# EAGLE schematic MicroMod_STM32_Processor (EAGLE 9.6.2)
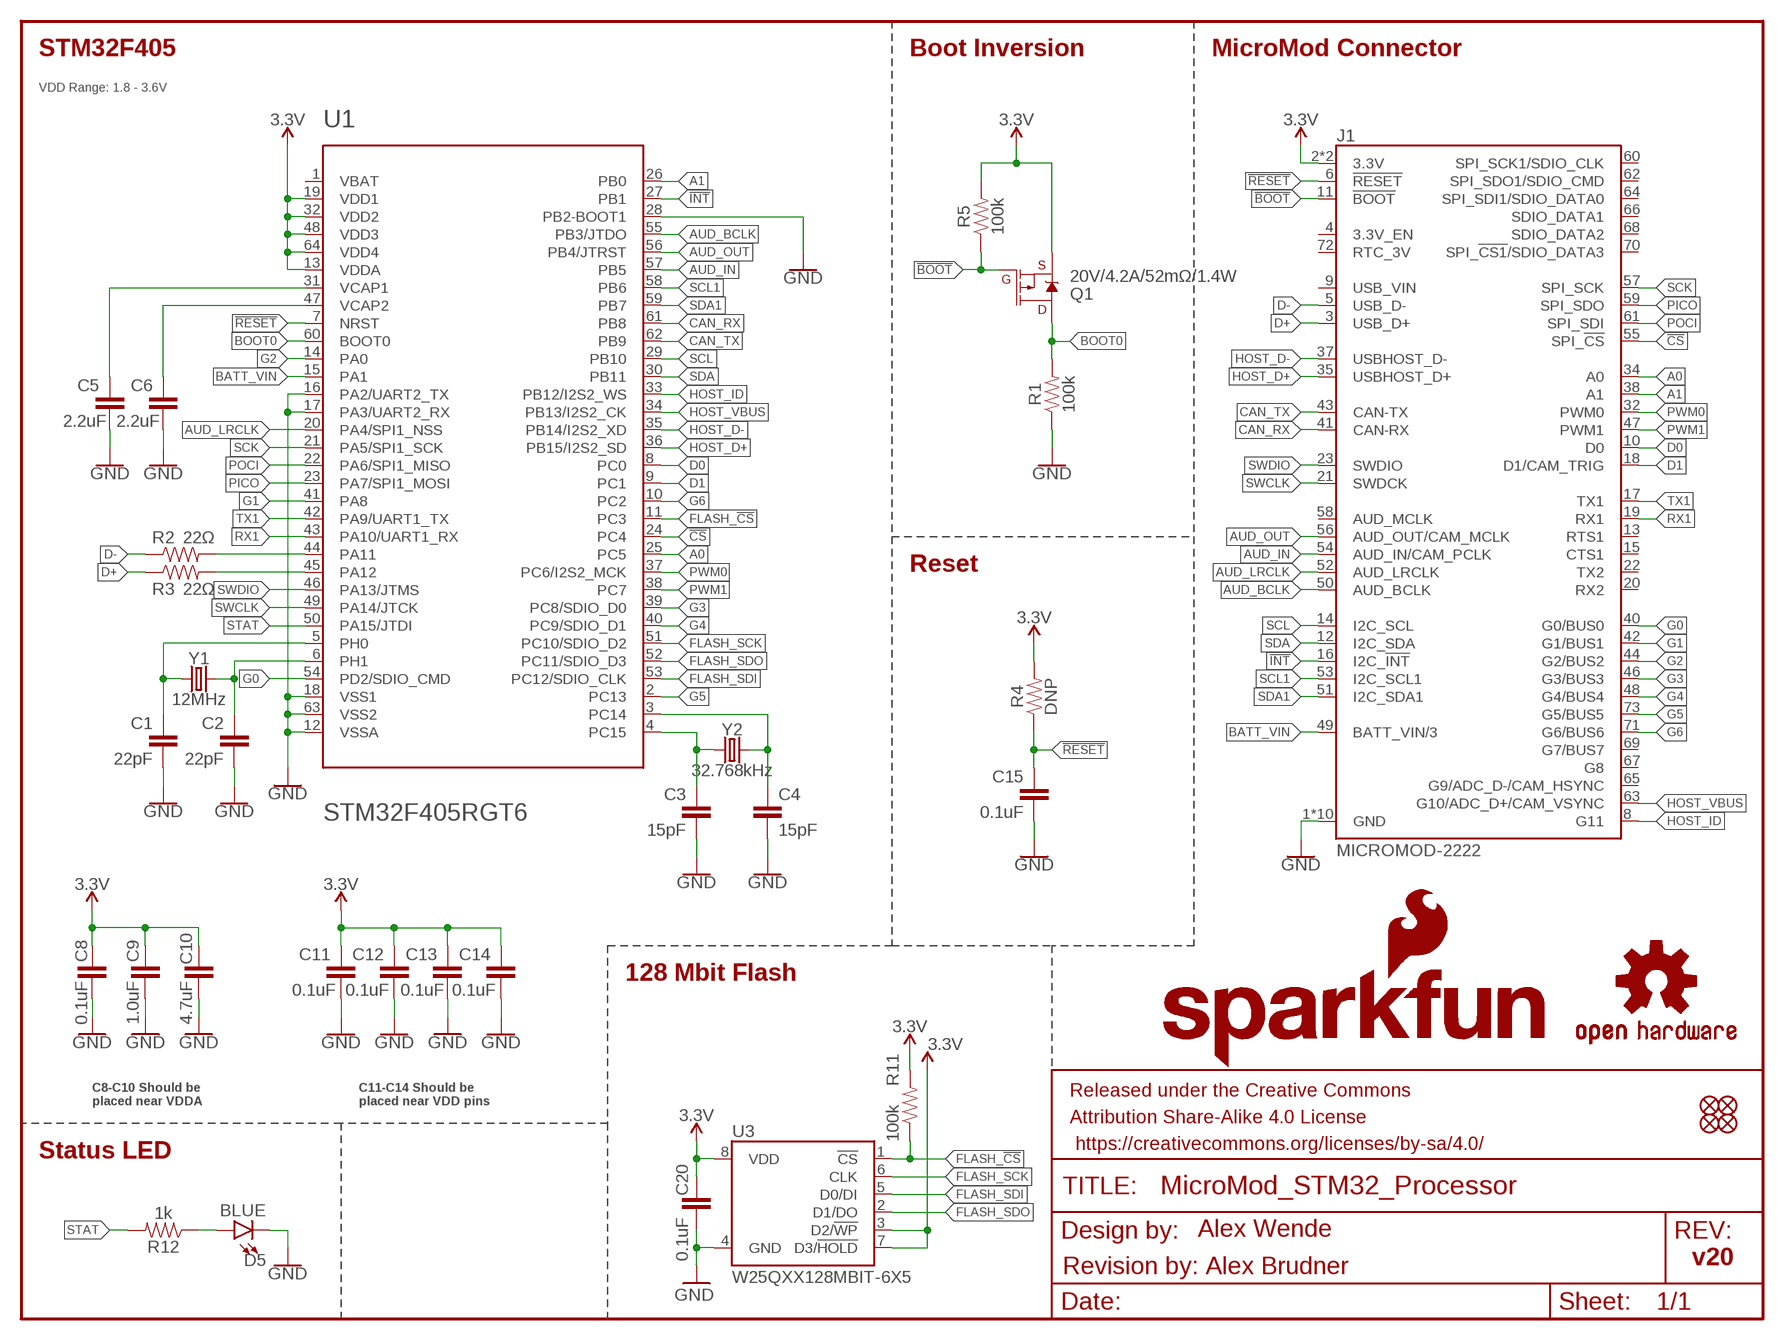
[diagram p0: schematic, sheet 1]

## Parts
C1  22pF  22PF-0402T-16V-10%  [0402-TIGHT]
C2  22pF  22PF-0402T-16V-10%  [0402-TIGHT]
C3  15pF  15PF-0402T-50V-5%  [0402-TIGHT]
C4  15pF  15PF-0402T-50V-5%  [0402-TIGHT]
C5  2.2uF  2.2UF-0402_TIGHT-10V-10%-X5R  [0402-TIGHT]
C6  2.2uF  2.2UF-0402_TIGHT-10V-10%-X5R  [0402-TIGHT]
C8  0.1uF  0.1UF-0402T-10V-10%-X7R  [0402-TIGHT]
C9  1.0uF  1.0UF-0402T-16V-10%  [0402-TIGHT]
C10  4.7uF  4.7UF-0402_TIGHT-6.3V-20%-X5R  [0402-TIGHT]
C11  0.1uF  0.1UF-0402T-10V-10%-X7R  [0402-TIGHT]
C12  0.1uF  0.1UF-0402T-10V-10%-X7R  [0402-TIGHT]
C13  0.1uF  0.1UF-0402T-10V-10%-X7R  [0402-TIGHT]
C14  0.1uF  0.1UF-0402T-10V-10%-X7R  [0402-TIGHT]
C15  0.1uF  0.1UF-0402T-10V-10%-X7R  [0402-TIGHT]
C20  0.1uF  0.1UF-0402T-10V-10%-X7R  [0402-TIGHT]
D5  BLUE  LED-BLUE0603  [LED-0603]
FD1  FIDUCIALUFIDUCIAL  [FIDUCIAL-MICRO]
FD2  FIDUCIALUFIDUCIAL  [FIDUCIAL-MICRO]
FD3  FIDUCIALUFIDUCIAL  [FIDUCIAL-MICRO]
FD4  FIDUCIALUFIDUCIAL  [FIDUCIAL-MICRO]
FRAME1  FRAME-LETTER  [CREATIVE_COMMONS]
J1  MICROMOD-2222  [M.2-CARD-E-22]
LOGO2  OSHW-LOGOS  [OSHW-LOGO-S]
LOGO3  SFE_LOGO_NAME_FLAME.1_INCH  [SFE_LOGO_NAME_FLAME_.1]
Q1  20V/4.2A/52mΩ/1.4W  MOSFET_PCH-DMG2305UX-7  [SOT23-3]
R1  100k  100KOHM-0402T-1/16W-1%  [0402-TIGHT]
R2  22Ω  22OHM-0402T-1/16W-1%  [0402-TIGHT]
R3  22Ω  22OHM-0402T-1/16W-1%  [0402-TIGHT]
R4  DNP  DNP-0402T_NO_CREAM  [0402-TIGHT_NO_CREAM]
R5  100k  100KOHM-0402T-1/16W-1%  [0402-TIGHT]
R11  100k  100KOHM-0402T-1/16W-1%  [0402-TIGHT]
R12  1k  1KOHM-0402T-1/16W-1%  [0402-TIGHT]
U1  STM32F405RGT6  STM32F405RG_LOGICAL  [TQFP64]
U3  W25QXX128MBIT-6X5  [WSON-8-6X5]
Y1  12MHz  CRYSTAL-12MHZ"  [CRYSTAL-SMD-5X3.2-4PAD]
Y2  32.768kHz  CRYSTAL-32.768KHZSMD-3.2X1.5  [CRYSTAL-SMD-3.2X1.5MM]

## Nets
3.3V: C8.1 C9.1 C10.1 C11.1 C12.1 C13.1 C14.1 C20.1 J1.2(3.3V) J1.74(3.3V) Q1.2(S) R4.2 R5.2 R11.2 U1.13(VDDA) U1.19(VDD1) U1.32(VDD2) U1.48(VDD3) U1.64(VDD4) U3.3(D2/!WP!) U3.7(D3/!HOLD!) U3.8(VDD)
!BOOT: J1.11(!BOOT!) Q1.1(G) R5.1
!CS: J1.55(SPI_!CS!) U1.24(PC4)
!INT: J1.16(I2C_!INT!) U1.27(PB1)
!RESET: C15.1 J1.6(!RESET!) R4.1 U1.7(NRST)
A0: J1.34(A0) U1.25(PC5)
A1: J1.38(A1) U1.26(PB0)
AUD_BCLK: J1.50(AUD_BCLK) U1.55(PB3/JTDO)
AUD_IN: J1.54(AUD_IN/CAM_PCLK) U1.57(PB5)
AUD_LRCLK: J1.52(AUD_LRCLK) U1.20(PA4/SPI1_NSS)
AUD_OUT: J1.56(AUD_OUT/CAM_MCLK) U1.56(PB4/JTRST)
BATT_VIN: J1.49(BATT_VIN/3) U1.15(PA1)
BOOT0: Q1.3(D) R1.2 U1.60(BOOT0)
CAN_RX: J1.41(CAN-RX) U1.61(PB8)
CAN_TX: J1.43(CAN-TX) U1.62(PB9)
D0: J1.10(D0) U1.8(PC0)
D1: J1.18(D1/CAM_TRIG) U1.9(PC1)
D+: J1.3(USB_D+) R3.1
D-: J1.5(USB_D-) R2.1
FLASH_!CS: R11.1 U1.11(PC3) U3.1(!CS!)
FLASH_SCK: U1.51(PC10/SDIO_D2) U3.6(CLK)
FLASH_SDI: U1.53(PC12/SDIO_CLK) U3.5(D0/DI)
FLASH_SDO: U1.52(PC11/SDIO_D3) U3.2(D1/DO)
G0: J1.40(G0/BUS0) U1.54(PD2/SDIO_CMD)
G1: J1.42(G1/BUS1) U1.41(PA8)
G2: J1.44(G2/BUS2) U1.14(PA0)
G3: J1.46(G3/BUS3) U1.39(PC8/SDIO_D0)
G4: J1.48(G4/BUS4) U1.40(PC9/SDIO_D1)
G5: J1.73(G5/BUS5) U1.2(PC13)
G6: J1.71(G6/BUS6) U1.10(PC2)
GND: C1.2 C2.2 C3.2 C4.2 C5.2 C6.2 C8.2 C9.2 C10.2 C11.2 C12.2 C13.2 C14.2 C15.2 C20.2 D5.C J1.1(GND) J1.7(GND) J1.33(GND) J1.36(GND) J1.39(GND) J1.45(GND) J1.75(GND) J1.GND1(GND) J1.GND2(GND) J1.GND3(GND) R1.1 U1.12(VSSA) U1.16(PA2/UART2_TX) U1.17(PA3/UART2_RX) U1.18(VSS1) U1.28(PB2-BOOT1) U1.63(VSS2) U3.4(GND)
HOST_D+: J1.35(USBHOST_D+) U1.36(PB15/I2S2_SD)
HOST_D-: J1.37(USBHOST_D-) U1.35(PB14/I2S2_XD)
HOST_ID: J1.8(G11) U1.33(PB12/I2S2_WS)
HOST_VBUS: J1.63(G10/ADC_D+/CAM_VSYNC) U1.34(PB13/I2S2_CK)
N$1: D5.A R12.1
N$2: R2.2 U1.44(PA11)
N$3: R3.2 U1.45(PA12)
N$5: C4.1 U1.3(PC14) Y2.P$2
N$6: C3.1 U1.4(PC15) Y2.P$1
N$7: C2.1 U1.6(PH1) Y1.3
N$8: C1.1 U1.5(PH0) Y1.1
N$45: C6.1 U1.47(VCAP2)
N$46: C5.1 U1.31(VCAP1)
PICO: J1.59(SPI_SDO) U1.23(PA7/SPI1_MOSI)
POCI: J1.61(SPI_SDI) U1.22(PA6/SPI1_MISO)
PWM0: J1.32(PWM0) U1.37(PC6/I2S2_MCK)
PWM1: J1.47(PWM1) U1.38(PC7)
RX1: J1.19(RX1) U1.43(PA10/UART1_RX)
SCK: J1.57(SPI_SCK) U1.21(PA5/SPI1_SCK)
SCL: J1.14(I2C_SCL) U1.29(PB10)
SCL1: J1.53(I2C_SCL1) U1.58(PB6)
SDA: J1.12(I2C_SDA) U1.30(PB11)
SDA1: J1.51(I2C_SDA1) U1.59(PB7)
STAT: R12.2 U1.50(PA15/JTDI)
SWCLK: J1.21(SWDCK) U1.49(PA14/JTCK)
SWDIO: J1.23(SWDIO) U1.46(PA13/JTMS)
TX1: J1.17(TX1) U1.42(PA9/UART1_TX)
Unconnected: J1.4(3.3V_EN) J1.9(USB_VIN) J1.13(RTS1) J1.15(CTS1) J1.20(RX2) J1.22(TX2) J1.58(AUD_MCLK) J1.60(SPI_SCK1/SDIO_CLK) J1.62(SPI_SDO1/SDIO_CMD) J1.64(SPI_SDI1/SDIO_DATA0) J1.65(G9/ADC_D-/CAM_HSYNC) J1.66(SDIO_DATA1) J1.67(G8) J1.68(SDIO_DATA2) J1.69(G7/BUS7) J1.70(SPI_!CS1!/SDIO_DATA3) J1.72(RTC_3V) U1.1(VBAT)

## Notes on the sheet
- STM32F405 | Boot Inversion | MicroMod Connector
- VDD Range: 1.8 - 3.6V
- Reset
- 128 Mbit Flash
- C8-C10 Should be 
  placed near VDDA
- C11-C14 Should be 
  placed near VDD pins
- Status LED
- Alex Wende
- v20
- Revision by: Alex Brudner

## Library data of the parts
C1 C2 = SparkFun-Capacitors:22PF: 22pF ceramic capacitors A capacitor is a passive two-terminal electrical component used to store electrical energy temporarily in an electric field.; PROD_ID: CAP-14674
C3 C4 = SparkFun-Capacitors:15PF: 15pF ceramic capacitors A capacitor is a passive two-terminal electrical component used to store electrical energy temporarily in an electric field.; PROD_ID: CAP-13063
C5 C6 = SparkFun-Capacitors:2.2UF: 2.2µF ceramic capacitors A capacitor is a passive two-terminal electrical component used to store electrical energy temporarily in an electric field.; PROD_ID: CAP-14232
C8 = SparkFun-Capacitors:0.1UF: 0.1µF ceramic capacitors A capacitor is a passive two-terminal electrical component used to store electrical energy temporarily in an electric field.; PROD_ID: CAP-15083; SPICEPREFIX: C
C9 = SparkFun-Capacitors:1.0UF: 1µF ceramic capacitors A capacitor is a passive two-terminal electrical component used to store electrical energy temporarily in an electric field.; PROD_ID: CAP-12417; SPICEPREFIX: C
C10 = SparkFun-Capacitors:4.7UF: 4.7µF ceramic capacitors A capacitor is a passive two-terminal electrical component used to store electrical energy temporarily in an electric field.; PROD_ID: CAP-14240; SPICEPREFIX: C
C11-C15 C20 = SparkFun-Capacitors:0.1UF: 0.1µF ceramic capacitors A capacitor is a passive two-terminal electrical component used to store electrical energy temporarily in an electric field.; PROD_ID: CAP-15083
D5 = SparkFun-LED:LED-BLUE: Blue SMD LED Used in manufacturing of various products at SparkFun Packages: 0603 - SMD 0603 package [Product Link] <http://www.digikey.com/product-detail/en/SMLE12BC7TT86/511-1589-2-ND/1641808> 1206 - SMD1206 package [Product Link] <http://www.digikey.com/product-detail/en/lite-on-inc/LTST-C150TBKT/160-1643-1-ND/573584> SparkFun Products: ESP8266 Thing-Dev Board <https://www.sparkfun.com/products/13711> RedBoard <https://www.sparkfun.com/products/12757>; PROD_ID: DIO-08575
FD1-FD4 = SparkFun-Aesthetics:FIDUCIAL: Fiducial Alignment Points Point-of-reference for pick-and-place machines and other optical instruments.
FRAME1 = SparkFun-Aesthetics:FRAME-LETTER: Schematic Frame - Letter Standard 8.5x11 US Letter frame
J1 = SparkFun-MicroMod:MICROMOD: MicroMod Connector Description: A card edge connector and mating PCB connector to allow various MicroMod Processor Boards to be coupled with various carrier boards of different capabilities. Based on the M.2 standard.
LOGO2 = SparkFun-Aesthetics:OSHW-LOGO: Open-Source Hardware (OSHW) Logo This logo indicates the piece of hardware it is found on incorporates a OSHW license and/or adheres to the definition of open source hardware found here: http://freedomdefined.org/OSHW
LOGO3 = SparkFun-Aesthetics:SFE_LOGO_NAME_FLAME: SparkFun Font Logo w/ Flame This is the SparkFun full logo. The logo on the schematic will always be the same size; the package variant is the height of the flame part of the logo. Default layer for the logo on the board is tSilk.
Q1 = SparkFun-DiscreteSemi:MOSFET_PCH: P-channel MOSFETs Voltage controlled devices that allow control of high current outputs. SparkFun Products: SparkFun ESP32 Thing <https://www.sparkfun.com/products/13907> SparkFun ESP8266 Thing <https://www.sparkfun.com/products/13231> SparkFun Pi Servo HAT V2 <https://www.sparkfun.com/products/15316> DMG2305UX-7 (20V/4.2A/SOT23-3); PROD_ID: TRANS-14388
R1 R5 R11 = SparkFun-Resistors:100KOHM: 100kΩ resistor A resistor is a passive two-terminal electrical component that implements electrical resistance as a circuit element. Resistors act to reduce current flow, and, at the same time, act to lower voltage levels within circuits. - Wikipedia; PROD_ID: RES-13495
R2 R3 = SparkFun-Resistors:22OHM: 22Ω resistor A resistor is a passive two-terminal electrical component that implements electrical resistance as a circuit element. Resistors act to reduce current flow, and, at the same time, act to lower voltage levels within circuits. - Wikipedia; PROD_ID: RES-12427
R4 = SparkFun-Resistors:DNP: Do-Not-Populate resistor A resistor is a passive two-terminal electrical component that implements electrical resistance as a circuit element. Resistors act to reduce current flow, and, at the same time, act to lower voltage levels within circuits. - Wikipedia
R12 = SparkFun-Resistors:1KOHM: 1kΩ resistor A resistor is a passive two-terminal electrical component that implements electrical resistance as a circuit element. Resistors act to reduce current flow, and, at the same time, act to lower voltage levels within circuits. - Wikipedia; PROD_ID: RES-14342
U1 = SparkFun-IC-Microcontroller:STM32F405RG_LOGICAL: STM32F405RGT6 ARM DSP Chip used on the WAV Trigger board. IC MCU 32BIT 1MB FLASH 64LQFP Datasheet <https://cdn.sparkfun.com/datasheets/Widgets/STM32F405RGT6.pdf> SparkFun Products WAV Trigger <https://www.sparkfun.com/products/13660> (WIG-13660); PROD_ID: IC-11709
U3 = SparkFun-MicroMod:W25QXX; PROD_ID: IC-15107
Y1 = SparkFun-Clocks:CRYSTAL-12MHZ: 12.0MHz Crystal Frequency: 12.0MHz Frequency Tolerance: ±20ppm Load Capacitance: 18pF SparkFun Products: SparkFun Logomatic <https://www.sparkfun.com/products/12772> Pocket AVR Programmer <https://www.sparkfun.com/products/9825>; PROD_ID: XTAL-08297
Y2 = SparkFun-Clocks:CRYSTAL-32.768KHZ: 32.768kHz Crystal Frequency: 32.768kHz Frequency Stability: ±20ppm Load Capacitance: 12.5pF (PTH-2X6 & SMD-3.2X1.5), 6pF (SMD-2X6) SparkFun Products: SparkFun BigTime Watch Kit <https://www.sparkfun.com/products/11734> SparkFun nRF52832 Breakout <https://www.sparkfun.com/products/13990> SparkFun Real Time Clock Module <https://www.sparkfun.com/products/12708>; PROD_ID: XTAL-13062